# Altium schematic sheet P-MT3620RDB-1-7_PIO.SchDoc: MT3620 RDB PIO
size A3; CompanyName: Microsoft Research; DrawnBy: Stuart Taylor; Revision: 1.7; SheetNumber: 2; SheetTotal: 5; ProjectName: MT3620 Reference Development Board
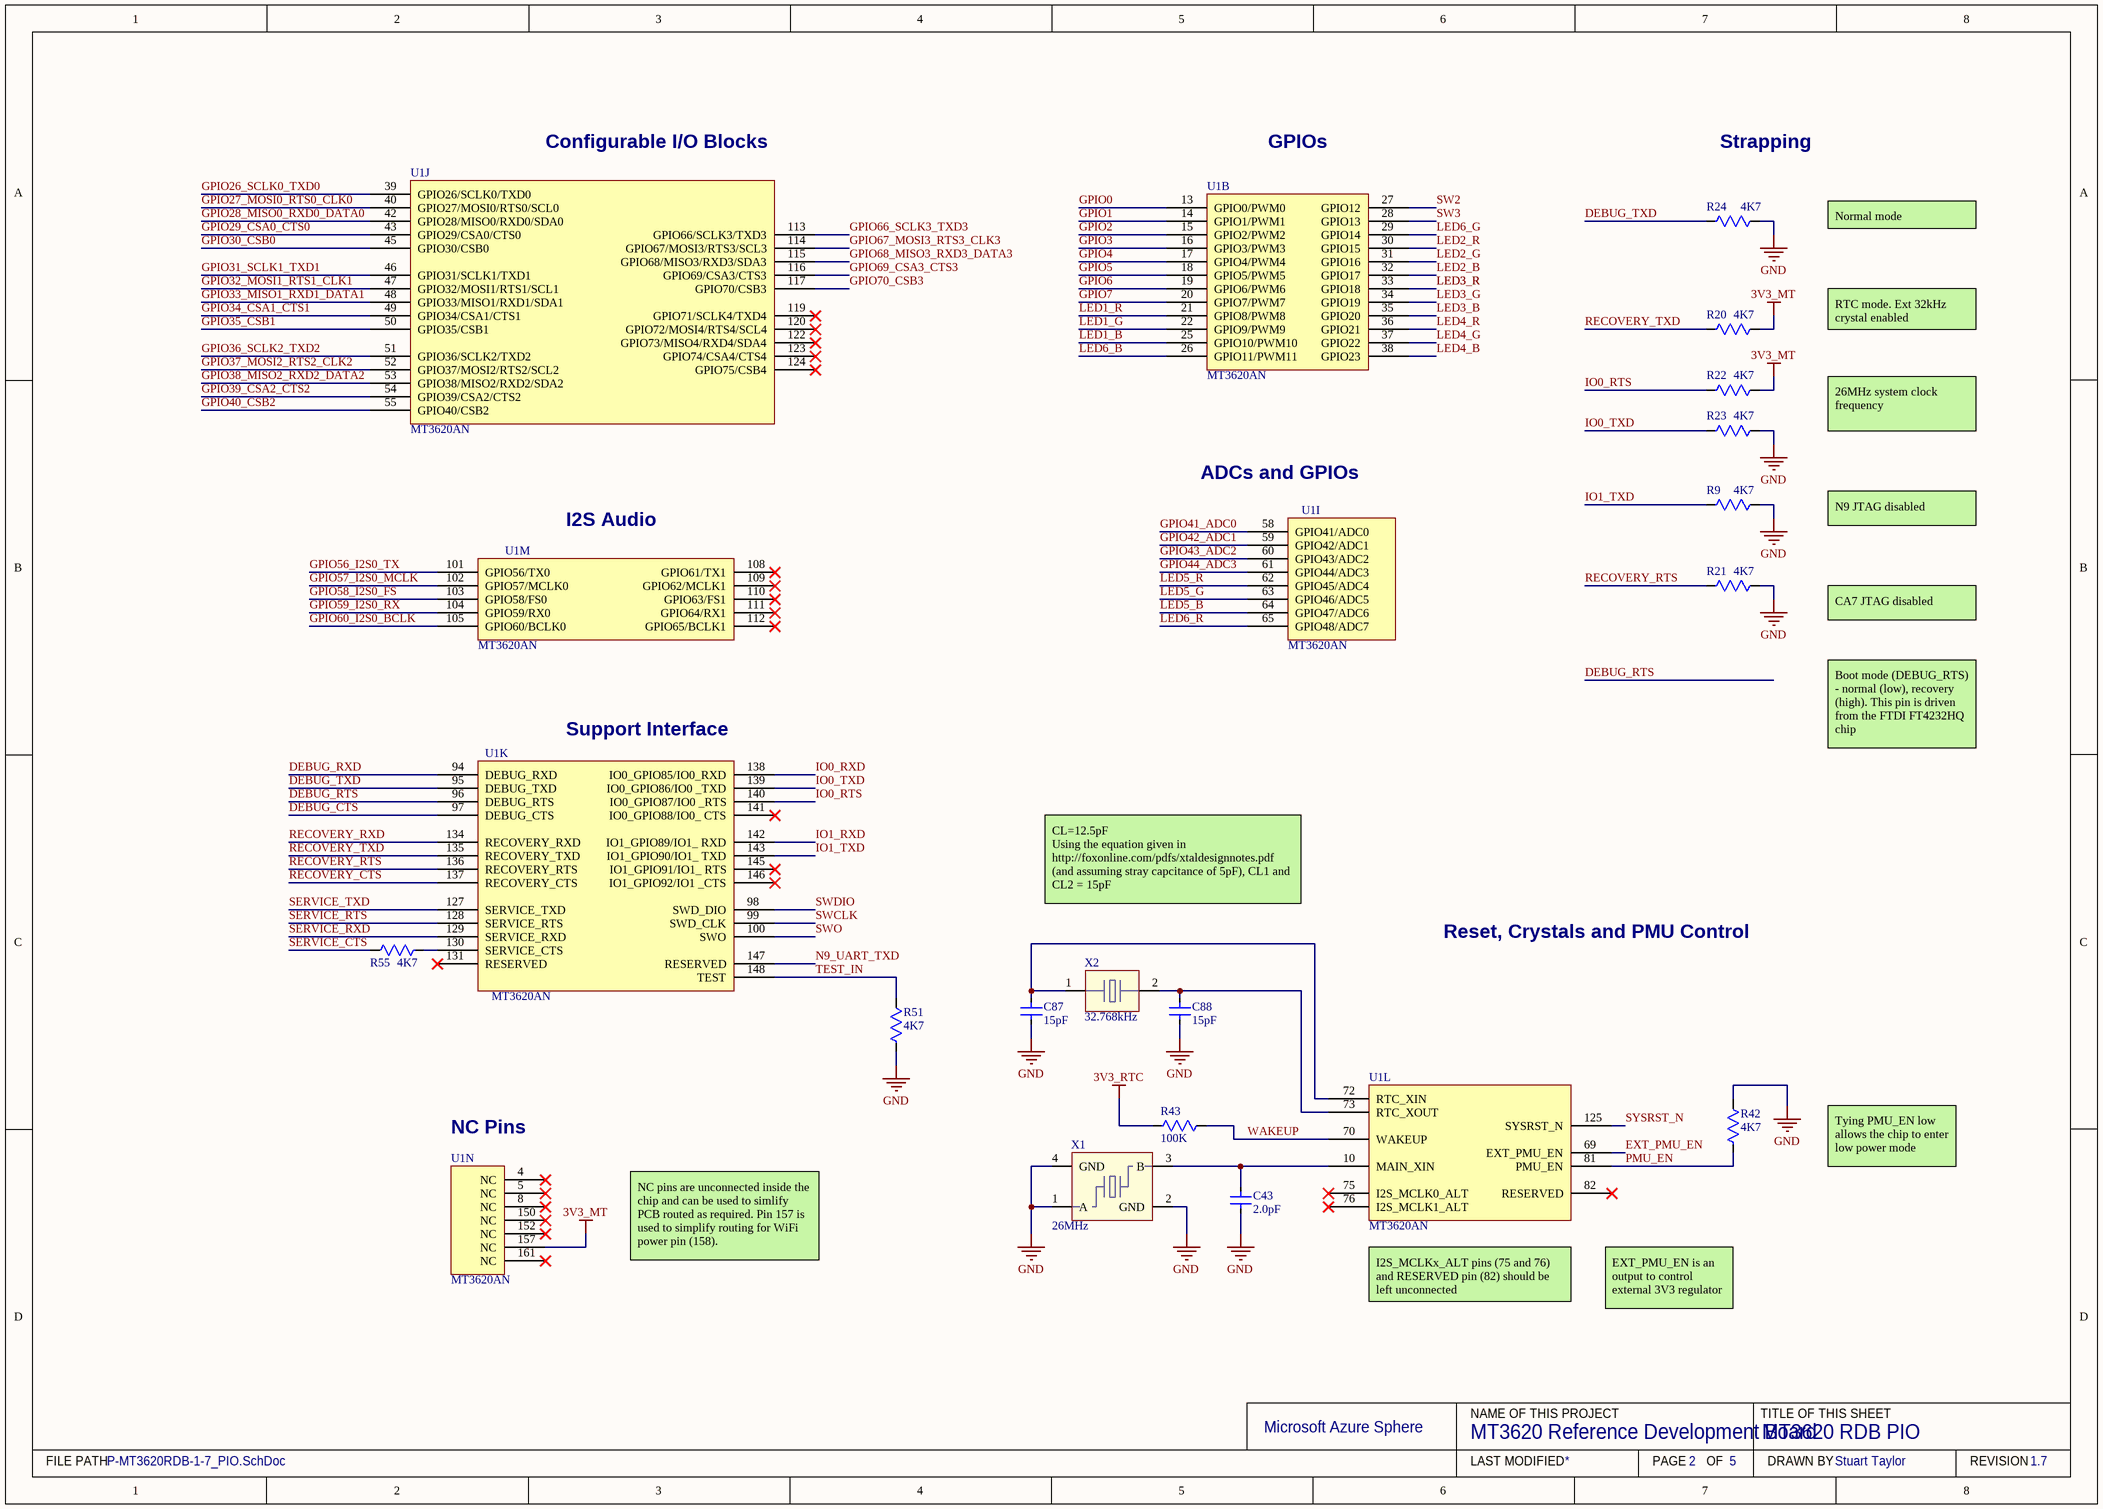
[diagram p0: P-MT3620RDB-1-7_PIO.SchDoc]

## Parts
C43  2.0pF  [CAPC1005-EIA0402 0.55MM MED]
C87  15pF  [CAPC1005-EIA0402 0.55MM MED]
C88  15pF  [CAPC1005-EIA0402 0.55MM MED]
R9  4K7  [RES 0402 MEDIUM DENSITY]
R20  4K7  [RES 0402 MEDIUM DENSITY]
R21  4K7  [RES 0402 MEDIUM DENSITY]
R22  4K7  [RES 0402 MEDIUM DENSITY]
R23  4K7  [RES 0402 MEDIUM DENSITY]
R24  4K7  [RES 0402 MEDIUM DENSITY]
R42  4K7  [RES 0402 MEDIUM DENSITY]
R43  100K  [RES 0402 MEDIUM DENSITY]
R51  4K7  [RES 0402 MEDIUM DENSITY]
R55  4K7  [RES 0402 MEDIUM DENSITY]
U1  MT3620AN  [MT3620_MaskSquaresVias50]  (parts B,I,J,K,L,M,N of 14)
X1  26MHz  [CT2520DB26000C0FZZA1]
X2  32.768kHz  [9HT10-32.768KDZF-T]

## Nets
3V3_MT: R20.1 R22.1 U1.157(NC)
3V3_RTC: R43.2
GND: C43.1 C87.1 C88.1 R9.1 R21.1 R23.1 R24.1 R42.1 R51.2 X1.1(A) X1.2(GND) X1.4(GND)
DEBUG_CTS: U1.97(DEBUG_CTS)
DEBUG_RTS: U1.96(DEBUG_RTS)
DEBUG_RXD: U1.94(DEBUG_RXD)
DEBUG_TXD: R24.2 U1.95(DEBUG_TXD)
EXT_PMU_EN: U1.69(EXT_PMU_EN)
GPIO0: U1.13(GPIO0/PWM0)
GPIO1: U1.14(GPIO1/PWM1)
GPIO2: U1.15(GPIO2/PWM2)
GPIO3: U1.16(GPIO3/PWM3)
GPIO4: U1.17(GPIO4/PWM4)
GPIO5: U1.18(GPIO5/PWM5)
GPIO6: U1.19(GPIO6/PWM6)
GPIO7: U1.20(GPIO7/PWM7)
GPIO26_SCLK0_TXD0: U1.39(GPIO26/SCLK0/TXD0)
GPIO27_MOSI0_RTS0_CLK0: U1.40(GPIO27/MOSI0/RTS0/SCL0)
GPIO28_MISO0_RXD0_DATA0: U1.42(GPIO28/MISO0/RXD0/SDA0)
GPIO29_CSA0_CTS0: U1.43(GPIO29/CSA0/CTS0)
GPIO30_CSB0: U1.45(GPIO30/CSB0)
GPIO31_SCLK1_TXD1: U1.46(GPIO31/SCLK1/TXD1)
GPIO32_MOSI1_RTS1_CLK1: U1.47(GPIO32/MOSI1/RTS1/SCL1)
GPIO33_MISO1_RXD1_DATA1: U1.48(GPIO33/MISO1/RXD1/SDA1)
GPIO34_CSA1_CTS1: U1.49(GPIO34/CSA1/CTS1)
GPIO35_CSB1: U1.50(GPIO35/CSB1)
GPIO36_SCLK2_TXD2: U1.51(GPIO36/SCLK2/TXD2)
GPIO37_MOSI2_RTS2_CLK2: U1.52(GPIO37/MOSI2/RTS2/SCL2)
GPIO38_MISO2_RXD2_DATA2: U1.53(GPIO38/MISO2/RXD2/SDA2)
GPIO39_CSA2_CTS2: U1.54(GPIO39/CSA2/CTS2)
GPIO40_CSB2: U1.55(GPIO40/CSB2)
GPIO41_ADC0: U1.58(GPIO41/ADC0)
GPIO42_ADC1: U1.59(GPIO42/ADC1)
GPIO43_ADC2: U1.60(GPIO43/ADC2)
GPIO44_ADC3: U1.61(GPIO44/ADC3)
GPIO56_I2S0_TX: U1.101(GPIO56/TX0)
GPIO57_I2S0_MCLK: U1.102(GPIO57/MCLK0)
GPIO58_I2S0_FS: U1.103(GPIO58/FS0)
GPIO59_I2S0_RX: U1.104(GPIO59/RX0)
GPIO60_I2S0_BCLK: U1.105(GPIO60/BCLK0)
GPIO66_SCLK3_TXD3: U1.113(GPIO66/SCLK3/TXD3)
GPIO67_MOSI3_RTS3_CLK3: U1.114(GPIO67/MOSI3/RTS3/SCL3)
GPIO68_MISO3_RXD3_DATA3: U1.115(GPIO68/MISO3/RXD3/SDA3)
GPIO69_CSA3_CTS3: U1.116(GPIO69/CSA3/CTS3)
GPIO70_CSB3: U1.117(GPIO70/CSB3)
IO0_RTS: R22.2 U1.140(IO0_GPIO87/IO0__RTS)
IO0_RXD: U1.138(IO0_GPIO85/IO0_RXD)
IO0_TXD: R23.2 U1.139(IO0_GPIO86/IO0__TXD)
IO1_RXD: U1.142(IO1_GPIO89/IO1__RXD)
IO1_TXD: R9.2 U1.143(IO1_GPIO90/IO1__TXD)
LED1_B: U1.25(GPIO10/PWM10)
LED1_G: U1.22(GPIO9/PWM9)
LED1_R: U1.21(GPIO8/PWM8)
LED2_B: U1.32(GPIO17)
LED2_G: U1.31(GPIO16)
LED2_R: U1.30(GPIO15)
LED3_B: U1.35(GPIO20)
LED3_G: U1.34(GPIO19)
LED3_R: U1.33(GPIO18)
LED4_B: U1.38(GPIO23)
LED4_G: U1.37(GPIO22)
LED4_R: U1.36(GPIO21)
LED5_B: U1.64(GPIO47/ADC6)
LED5_G: U1.63(GPIO46/ADC5)
LED5_R: U1.62(GPIO45/ADC4)
LED6_B: U1.26(GPIO11/PWM11)
LED6_G: U1.29(GPIO14)
LED6_R: U1.65(GPIO48/ADC7)
N9_UART_TXD: U1.147(RESERVED)
PMU_EN: R42.2 U1.81(PMU_EN)
RECOVERY_CTS: U1.137(RECOVERY_CTS)
RECOVERY_RTS: R21.2 U1.136(RECOVERY_RTS)
RECOVERY_RXD: U1.134(RECOVERY_RXD)
RECOVERY_TXD: R20.2 U1.135(RECOVERY_TXD)
SERVICE_CTS: R55.1
SERVICE_RTS: U1.128(SERVICE_RTS)
SERVICE_RXD: U1.129(SERVICE_RXD)
SERVICE_TXD: U1.127(SERVICE_TXD)
SW2: U1.27(GPIO12)
SW3: U1.28(GPIO13)
SWCLK: U1.99(SWD_CLK)
SWDIO: U1.98(SWD_DIO)
SWO: U1.100(SWO)
SYSRST_N: U1.125(SYSRST_N)
TEST_IN: R51.1 U1.148(TEST)
WAKEUP: R43.1 U1.70(WAKEUP)
NetC43_2: C43.2 U1.10(MAIN_XIN) X1.3(B)
NetC87_2: C87.2 U1.72(RTC_XIN) X2.1
NetC88_2: C88.2 U1.73(RTC_XOUT) X2.2
NetR55_2: R55.2 U1.130(SERVICE_CTS)

Not connected (* = marked no-connect by the designer): U1 4(NC)* 5(NC)* 8(NC)* 75(I2S_MCLK0_ALT)* 76(I2S_MCLK1_ALT)* 82(RESERVED)* 108(GPIO61/TX1)* 109(GPIO62/MCLK1)* 110(GPIO63/FS1)* 111(GPIO64/RX1)* 112(GPIO65/BCLK1)* 119(GPIO71/SCLK4/TXD4)* 120(GPIO72/MOSI4/RTS4/SCL4)* 122(GPIO73/MISO4/RXD4/SDA4)* 123(GPIO74/CSA4/CTS4)* 124(GPIO75/CSB4)* 131(RESERVED)* 141(IO0_GPIO88/IO0__CTS)* 145(IO1_GPIO91/IO1__RTS)* 146(IO1_GPIO92/IO1__CTS)* 150(NC)* 152(NC)* 161(NC)*

## Notes on the sheet
- (near U1) Configurable I/O Blocks
- GPIOs
- Strapping
- Normal mode
- RTC mode. Ext 32kHz crystal enabled
- 26MHz system clock frequency
- (near U1) ADCs and GPIOs
- (near U1) I2S Audio
- N9 JTAG disabled
- CA7 JTAG disabled
- (near U1) Support Interface
- Boot mode (DEBUG_RTS) - normal (low), recovery (high). This pin is driven from the FTDI FT4232HQ chip
- CL=12.5pF
  Using the equation given in http://foxonline.com/pdfs/xtaldesignnotes.pdf (and assuming stray capcitance of 5pF), CL1 and CL2 = 15pF
- Reset, Crystals and PMU Control
- (near U1) NC Pins
- Tying PMU_EN low allows the chip to enter low power mode
- NC pins are unconnected inside the chip and can be used to simlify PCB routed as required. Pin 157 is used to simplify routing for WiFi power pin (158).
- (near U1) I2S_MCLKx_ALT pins (75 and 76) and RESERVED pin (82) should be left unconnected
- (near U1) EXT_PMU_EN is an output to control external 3V3 regulator
- Microsoft Azure Sphere
- NAME OF THIS PROJECT
- TITLE OF THIS SHEET
- FILE PATH
- LAST MODIFIED
- PAGE
- OF
- DRAWN BY
- REVISION

## Library data of the parts
C43 = 2.0pF 0402 C0G, NP0 50V: CAP CER 2PF 50V NP0 0402; Manufacturer: TDK Corporation; Manufacturer Part Number: C1005C0G1H020C050BA; Tolerance: ±0.25pF; Supplier 1: Digi-Key; RoHS: RoHS Compliant; Category: Capacitors; Stock 1: 47833; Pricing 1: 0.00302; Packaging: Tape & Reel (TR); Voltage - Rated: 50V; Temperature Coefficient: C0G, NP0; Mounting Type: Surface Mount, MLCC; Operating Temperature: -55°C ~ 125°C; Applications: General Purpose; Package / Case: 0402 (1005 Metric); Size / Dimension: 0.039" L x 0.020" W (1.00mm x 0.50mm); Height - Seated (Max): -; Thickness (Max): 0.022" (0.55mm); Lead Spacing: -; Features: -; Lead Style: -; ComponentLink1URL: http://product.tdk.com/en/catalog/datasheets/mlcc_commercial_general_en.pdf; ComponentLink1Description: http://product.tdk.com/en/catalog/datasheets/mlcc_commercial_general_en.pdf; Supplier Part Number 1: 445-4863-2-ND; Ratings: -; Capacitance: 2.0pF
C87 C88 = 15pF 0402 C0G, NP0 50V: CAP CER 15PF 50V 5% NP0 0402; Manufacturer: TDK Corporation; Manufacturer Part Number: C1005C0G1H150J050BA; Supplier 1: Digi-Key; RoHS: RoHS Compliant; Category: Capacitors; Stock 1: 47833; Pricing 1: 0.00274; Packaging: Tape & Reel (TR); Tolerance: ±5%; Voltage - Rated: 50V; Temperature Coefficient: C0G, NP0; Mounting Type: Surface Mount, MLCC; Operating Temperature: -55°C ~ 125°C; Applications: General Purpose; Package / Case: 0402 (1005 Metric); Size / Dimension: 0.039" L x 0.020" W (1.00mm x 0.50mm); Height - Seated (Max): -; Thickness (Max): 0.022" (0.55mm); Lead Spacing: -; Features: -; Lead Style: -; ComponentLink1URL: http://product.tdk.com/en/catalog/datasheets/mlcc_commercial_general_en.pdf; ComponentLink1Description: http://product.tdk.com/en/catalog/datasheets/mlcc_commercial_general_en.pdf; Supplier Part Number 1: 445-1237-2-ND; Ratings: -; Capacitance: 15pF
R9 R20-R24 R42 R51 R55 = 4.7K: RES 4.7K OHM 1/10W 1% 0402 SMD; Manufacturer: Panasonic Electronic Components; Manufacturer Part Number: ERJ-2RKF4701X; Power (Watts): 0.1W, 1/10W; Temperature Coefficient: ±100ppm/°C; Supplier 1: Digi-Key; Supplier Part Number 1: P4.70KLCT-ND; RoHS: RoHS Compliant; Category: Resistors; Stock 1: 1251398; Pricing 1: 1=0.07, 50=0.0128, 100=0.0097, 250=0.0072, 500=0.00532, 1000=0.00355, 5000=0.0025 (GBP); Packaging: Cut Tape (CT); Tolerance: ±1%; Composition: Thick Film; Features: -; Package / Case: 0402 (1005 Metric); Supplier Device Package: 0402; Size / Dimension: 0.039" L x 0.020" W (1.00mm x 0.50mm); Height: 0.016" (0.40mm); Number of Terminations: 2; ComponentLink1URL: http://industrial.panasonic.com/www-cgi/jvcr13pz.cgi?E+PZ+3+AOA0002+ERJ2RKF4701X+7+WW; ComponentLink1Description: http://industrial.panasonic.com/www-cgi/jvcr13pz.cgi?E+PZ+3+AOA0002+ERJ2RKF4701X+7+WW; Resistance (Ohms): 4K7
R43 = 100K: RES 100K OHM 1/10W 1% 0402 SMD; Manufacturer: Panasonic Electronic Components; Manufacturer Part Number: ERJ-2RKF1003X; Power (Watts): 0.1W, 1/10W; Temperature Coefficient: ±100ppm/°C; Supplier 1: Digi-Key; Supplier Part Number 1: P100KLCT-ND; RoHS: RoHS Compliant; Category: Resistors; Stock 1: 2310913; Pricing 1: 1=0.07, 50=0.0128, 100=0.0097, 250=0.0072, 500=0.00532, 1000=0.00355, 5000=0.0025 (GBP); Packaging: Cut Tape (CT); Tolerance: ±1%; Composition: Thick Film; Features: -; Package / Case: 0402 (1005 Metric); Supplier Device Package: 0402; Size / Dimension: 0.039" L x 0.020" W (1.00mm x 0.50mm); Height: 0.016" (0.40mm); Number of Terminations: 2; ComponentLink1URL: http://industrial.panasonic.com/www-cgi/jvcr13pz.cgi?E+PZ+3+AOA0002+ERJ2RKF1003X+7+WW; ComponentLink1Description: http://industrial.panasonic.com/www-cgi/jvcr13pz.cgi?E+PZ+3+AOA0002+ERJ2RKF1003X+7+WW; Resistance (Ohms): 100K
U1 = MT3620AN: Manufacturer: MediaTek Inc.; Manufacturer Part Number: MT3620AN; Supplier Part Number 1: MT3620AN; Supplier 1: MediaTek Inc.
X1 = XTL581100-M118-0804: 26MHz crystal; Manufacturer: Siward; Do Not Substitute: true; Manufacturer Part Number: XTL581100-M118-0804; Supplier Part Number 1: XTL581100-M118-0804; Supplier 1: Siward
X2 = 9HT10-32.768KDZF-T: 32.768kHz ±20ppm Crystal 12.5pF 70 kOhm -40°C ~ 85°C  Surface Mount 2-SMD; Manufacturer: TXC; Featured Product: 9HT Series Quartz Crystals; ESR (Equivalent Series Resistance): 70 kOhm; Operating Mode: Fundamental; Dynamic Catalog: 9HT10 Series; Other Names: 887-1504-1; Supplier 1: Digikey; Manufacturer Part Number: 9HT10-32.768KDZF-T; Stock 1: 19910; Pricing 1: 1=0.66, 10=0.55, 50=0.495, 100=0.44, 500=0.418, 1000=0.352 (USD); Standard Package: 1; Category: Crystals and Oscillators; Family: Crystals; Series: 9HT10; Type: kHz Crystal (Tuning Fork); Frequency: 32.768kHz; Frequency Tolerance: ±20ppm; Load Capacitance: 12.5pF; Operating Temperature: -40°C ~ 85°C; Mounting Type: Surface Mount; Package / Case: 2-SMD; Size / Dimension: 0.126" L x 0.059" W (3.20mm x 1.50mm); Height: 0.033" (0.85mm); Packaging: Cut Tape (CT); ComponentLink1URL: https://datasheet.ciiva.com/26833/getdatasheetpartid-743086-26833338.pdf; ComponentLink1Description: https://datasheet.ciiva.com/26833/getdatasheetpartid-743086-26833338.pdf; ComponentLink2URL: https://datasheet.ciiva.com/856/9ht10-856048.pdf; ComponentLink2Description: https://datasheet.ciiva.com/856/9ht10-856048.pdf; ComponentLink3URL: https://datasheet.ciiva.com/856/9ht10-856047.pdf; ComponentLink3Description: https://datasheet.ciiva.com/856/9ht10-856047.pdf; ComponentLink4URL: https://datasheet.ciiva.com/856/9ht10-856046.pdf; ComponentLink4Description: https://datasheet.ciiva.com/856/9ht10-856046.pdf; Supplier Part Number 1: 887-1504-1-ND